# EAGLE design floppy IDC to SMT rev A (EAGLE 9.6.2)
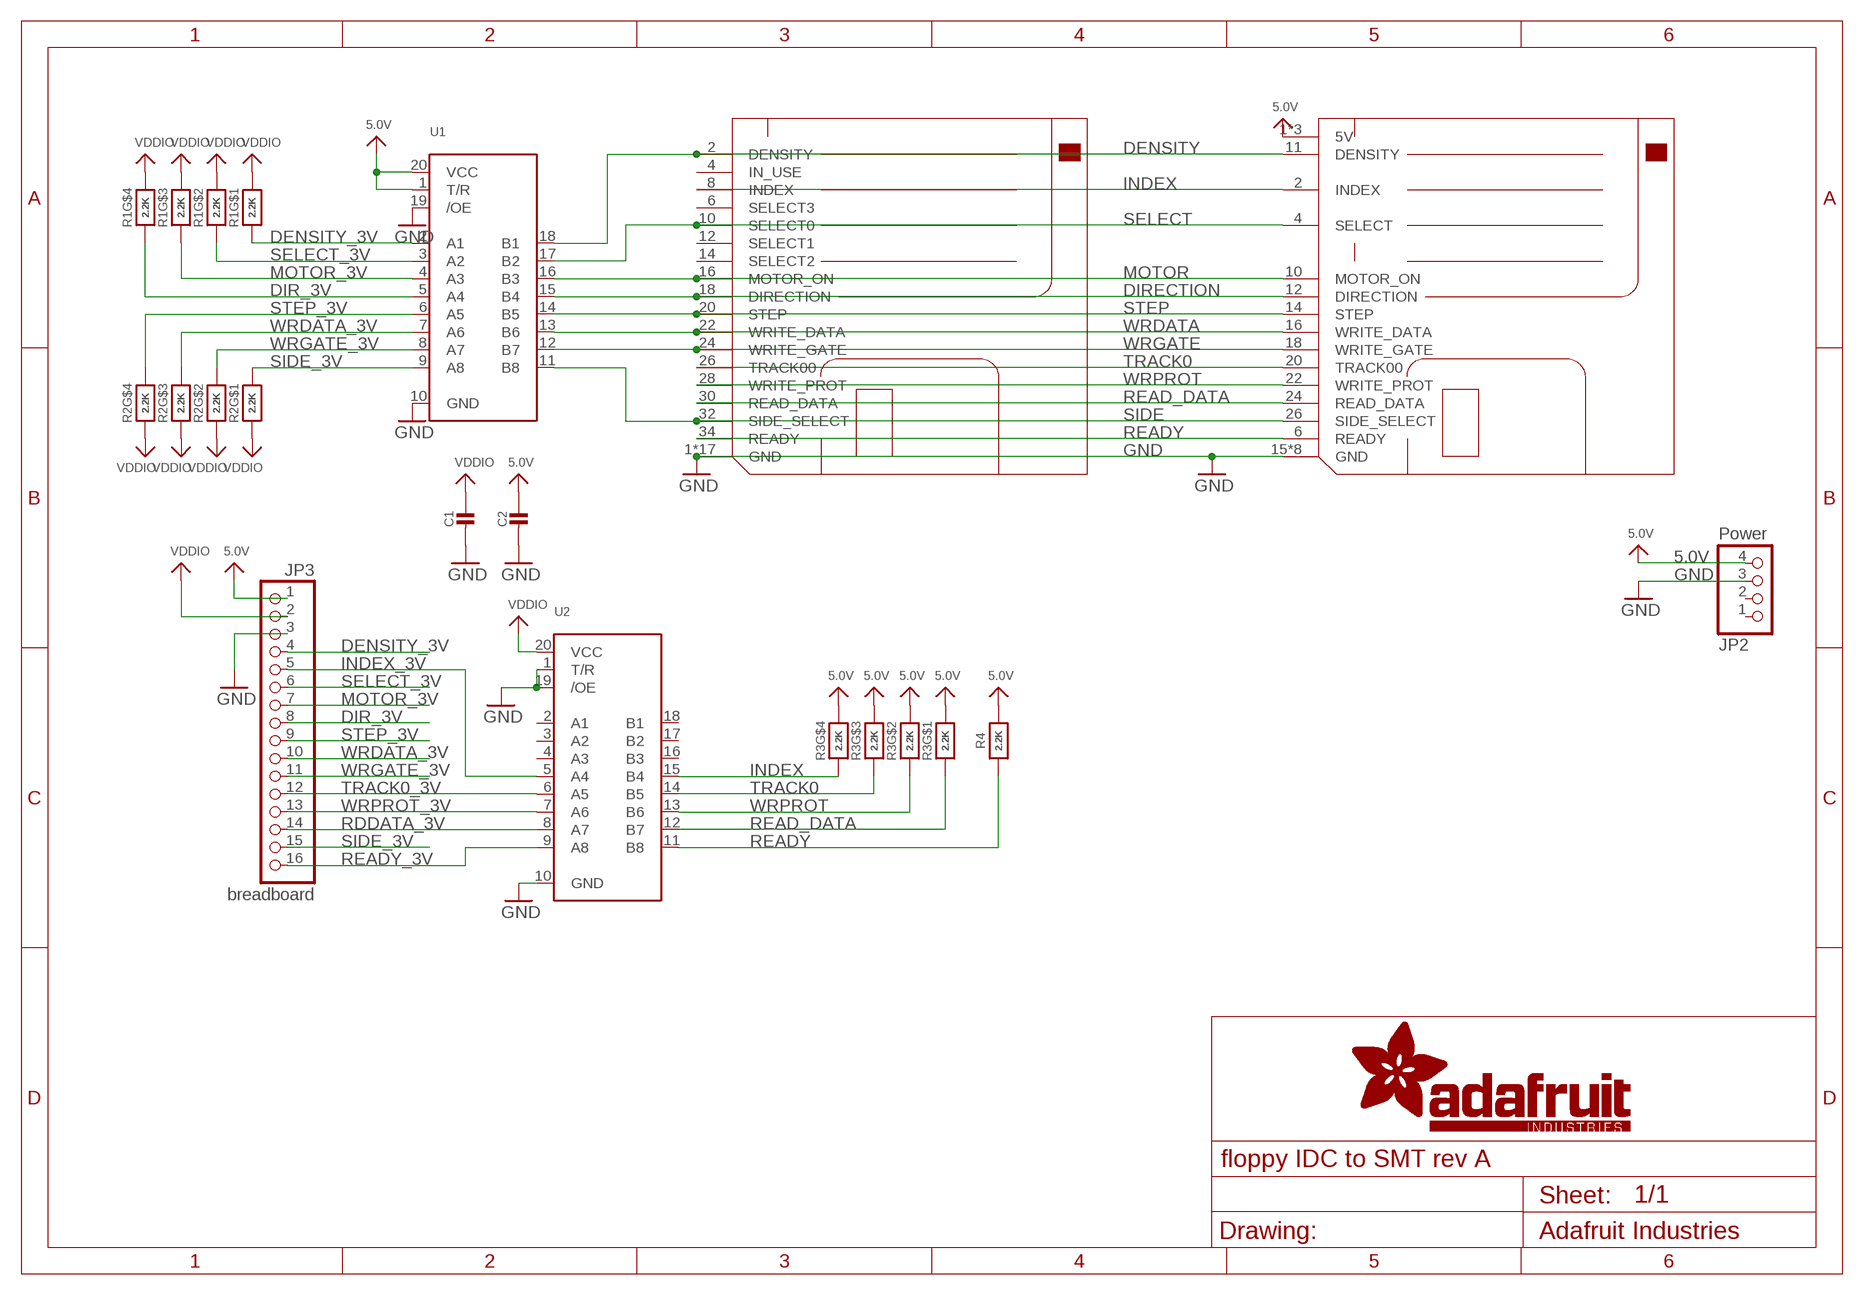
[diagram p0: schematic, sheet 1]

## Parts
C1  CAP_CERAMIC0805-NOOUTLINE  [0805-NO]
C2  CAP_CERAMIC0805-NOOUTLINE  [0805-NO]
FDD1  FLOPPY_IDC_SHROUDED  [2X17_FLOPPY_IDC]
FDD2  FLOPPY_FPC  [FPC_26P_1MM]
JP2  Power  PINHD-1X4/90  [1X04/90]
JP3  breadboard  PINHD-1X16  [1X16]
R1  2.2K  RESISTOR_4PACK  [RESPACK_4X0603]
R2  2.2K  RESISTOR_4PACK  [RESPACK_4X0603]
R3  2.2K  RESISTOR_4PACK  [RESPACK_4X0603]
R4  2.2K  RESISTOR_0603_NOOUT  [0603-NO]
U1  74LCX245  [TSSOP20]
U2  74LCX245  [TSSOP20]

## Nets
5.0V: C2.1 FDD2.1(5V) FDD2.3(5V) FDD2.5(5V) JP2.4 JP3.1 R3.5 R3.6 R3.7 R3.8 R4.2 U1.1(T/R) U1.20(VCC)
DENSITY: FDD1.2(DENSITY) FDD2.11(DENSITY) U1.18(B1)
DENSITY_3V: JP3.4 R1.1 U1.2(A1)
DIR_3V: JP3.8 R1.4 U1.5(A4)
DIRECTION: FDD1.18(DIRECTION) FDD2.12(DIRECTION) U1.15(B4)
GND: C1.2 C2.2 FDD1.1(GND) FDD1.3(GND) FDD1.5(GND) FDD1.7(GND) FDD1.9(GND) FDD1.11(GND) FDD1.13(GND) FDD1.15(GND) FDD1.17(GND) FDD1.19(GND) FDD1.21(GND) FDD1.23(GND) FDD1.25(GND) FDD1.27(GND) FDD1.29(GND) FDD1.31(GND) FDD1.33(GND) FDD2.15(GND) FDD2.17(GND) FDD2.19(GND) FDD2.21(GND) FDD2.23(GND) FDD2.25(GND) FDD2.M1(GND) FDD2.M2(GND) JP2.3 JP3.3 U1.10(GND) U1.19(/OE) U2.1(T/R) U2.10(GND) U2.19(/OE)
INDEX: FDD1.8(INDEX) FDD2.2(INDEX) R3.4 U2.15(B4)
INDEX_3V: JP3.5 U2.5(A4)
MOTOR: FDD1.16(MOTOR_ON) FDD2.10(MOTOR_ON) U1.16(B3)
MOTOR_3V: JP3.7 R1.3 U1.4(A3)
RDDATA_3V: JP3.14 U2.8(A7)
READ_DATA: FDD1.30(READ_DATA) FDD2.24(READ_DATA) R3.1 U2.12(B7)
READY: FDD1.34(READY) FDD2.6(READY) R4.1 U2.11(B8)
READY_3V: JP3.16 U2.9(A8)
SELECT: FDD1.10(SELECT0) FDD2.4(SELECT) U1.17(B2)
SELECT_3V: JP3.6 R1.2 U1.3(A2)
SIDE: FDD1.32(SIDE_SELECT) FDD2.26(SIDE_SELECT) U1.11(B8)
SIDE_3V: JP3.15 R2.8 U1.9(A8)
STEP: FDD1.20(STEP) FDD2.14(STEP) U1.14(B5)
STEP_3V: JP3.9 R2.5 U1.6(A5)
TRACK0: FDD1.26(TRACK00) FDD2.20(TRACK00) R3.3 U2.14(B5)
TRACK0_3V: JP3.12 U2.6(A5)
VDDIO: C1.1 JP3.2 R1.5 R1.6 R1.7 R1.8 R2.1 R2.2 R2.3 R2.4 U2.20(VCC)
WRDATA: FDD1.22(WRITE_DATA) FDD2.16(WRITE_DATA) U1.13(B6)
WRDATA_3V: JP3.10 R2.6 U1.7(A6)
WRGATE: FDD1.24(WRITE_GATE) FDD2.18(WRITE_GATE) U1.12(B7)
WRGATE_3V: JP3.11 R2.7 U1.8(A7)
WRPROT: FDD1.28(WRITE_PROT) FDD2.22(WRITE_PROT) R3.2 U2.13(B6)
WRPROT_3V: JP3.13 U2.7(A6)
Unconnected: FDD1.4(IN_USE) FDD1.6(SELECT3) FDD1.12(SELECT1) FDD1.14(SELECT2) JP2.1 JP2.2 U2.2(A1) U2.3(A2) U2.4(A3) U2.16(B3) U2.17(B2) U2.18(B1)

## Library data of the parts
C1 C2 = microbuilder:CAP_CERAMIC: Ceramic Capacitors For new designs, use the packages preceded by an '_' character since they are more reliable: The following footprints should be used on most boards: _0402 - Standard footprint for regular board layouts _0603 - Standard footprint for regular board layouts _0805 - Standard footprint for regular board layouts _1206 - Standard footprint for regular board layouts For extremely tight-pitch boards where space is at a premium, the following 'micro-pitch' footprints can be used (smaller pads, no silkscreen outline, etc.): _0402MP - Micro-pitch footprint for very dense/compact boards _0603MP - Micro-pitch footprint for very dense/compact boards _0805MP - Micro-pitch footprint for very dense/compact boards _1206MP - Micro-pitch footprint for very dense/compact boards
FDD1 = adafruit_electromech:FLOPPY_IDC
FDD2 = adafruit_electromech:FLOPPY_FPC
JP2 = pinhead:PINHD-1X4: PIN HEADER
JP3 = pinhead:PINHD-1X16: PIN HEADER
R1-R3 = microbuilder:RESISTOR_4PACK: Resistor Packs (4 resistors) 4 x 0603 10K 1/16W - Digikey: YC164J-10KCT-ND
R4 = microbuilder:RESISTOR: Resistors For new designs, use the packages preceded by an '_' character since they are more reliable: The following footprints should be used on most boards: _0402 - Standard footprint for regular board layouts _0603 - Standard footprint for regular board layouts _0805 - Standard footprint for regular board layouts _1206 - Standard footprint for regular board layouts For extremely tight-pitch boards where space is at a premium, the following 'micro-pitch' footprints can be used (smaller pads, no silkscreen outline, etc.): _0402MP - Micro-pitch footprint for very dense/compact boards _0603MP - Micro-pitch footprint for very dense/compact boards _0805MP - Micro-pitch footprint for very dense/compact boards _1206MP - Micro-pitch footprint for very dense/compact boards
U1 U2 = microbuilder:74LCX245: 74LCX245MTC - 5.0V Tolerant Bi-Directional Buffer Can be used to interface 5.0V logic to 2.5 or 3.3V devices Digikey: 74LCX245MTCXTR-ND Mouser: 512-74LCX245MTCX

## Board
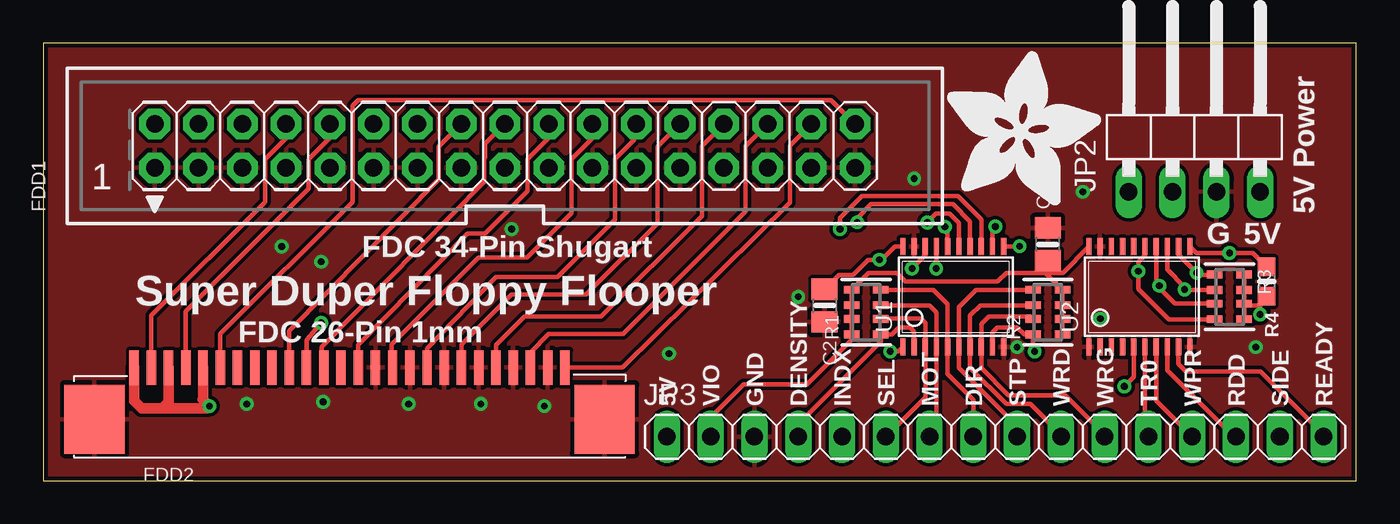
[diagram p1: board, top side]
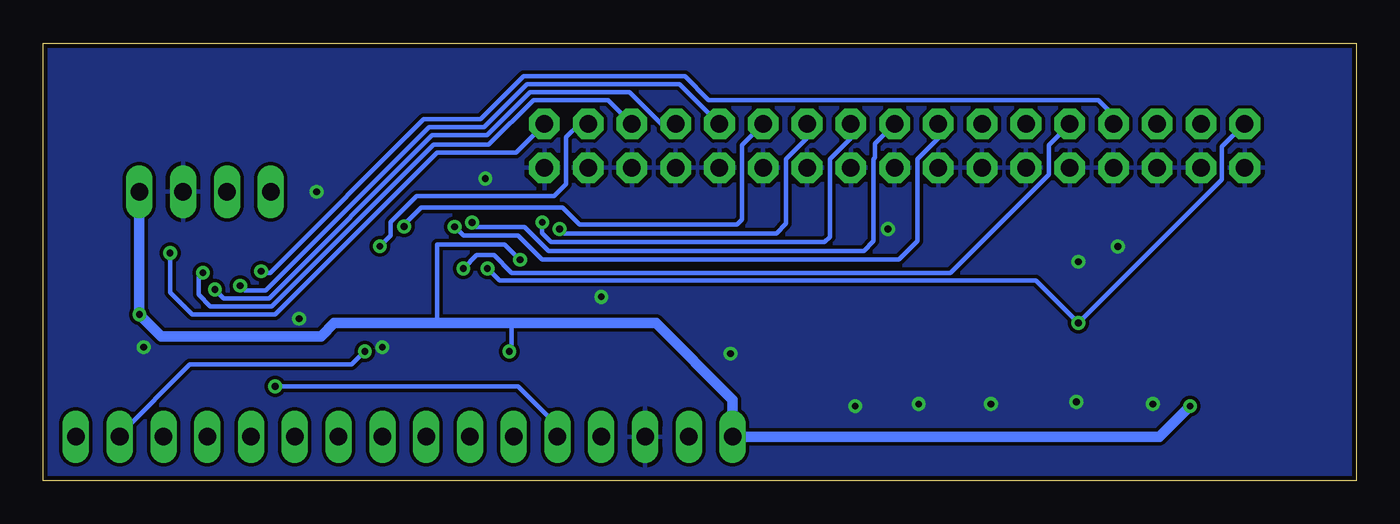
[diagram p2: board, bottom side, seen from below]

Size 76.2 x 25.4 mm. Coordinates in mm from the lower left corner, seen from the top.
Outline: 0,0 76.2,0 76.2,25.4 0,25.4 0,0
Copper layers (1*16): Top 0.035mm / dielectric 1.5mm / Bottom 0.035mm
Design rules "adafruit": minimum track width 8mil, minimum drill 15.5mil, track to track 8mil, track to pad 8mil, pad to pad 8mil, via to via 8mil, smd to smd 8mil, copper to edge 10mil, drill to drill 8mil, minimum pad ring 10mil, minimum via ring 8mil, stop-mask expansion 2mil, vias tented up to drill 20mil, thermal gap 10mil

### Footprints (pad centres in the part's own frame; a part is rotated, then mirrored left to right if it is on the bottom)
0805-NO = smd 1.24 x 1.5: 1 -0.95,0; 2 0.95,0
2X17_FLOPPY_IDC = drill 1.016 pad 1.778 octagon: 1 -1.27,20.32; 2 1.27,20.32; 3 -1.27,17.78; 4 1.27,17.78; 5 -1.27,15.24; 6 1.27,15.24; 7 -1.27,12.7; 8 1.27,12.7; 9 -1.27,10.16; 10 1.27,10.16; 11 -1.27,7.62; 12 1.27,7.62; 13 -1.27,5.08; 14 1.27,5.08; 15 -1.27,2.54; 16 1.27,2.54; 17 -1.27,0; 18 1.27,0; 19 -1.27,-2.54; 20 1.27,-2.54; 21 -1.27,-5.08; 22 1.27,-5.08; 23 -1.27,-7.62; 24 1.27,-7.62; 25 -1.27,-10.16; 26 1.27,-10.16; 27 -1.27,-12.7; 28 1.27,-12.7; 29 -1.27,-15.24; 30 1.27,-15.24; 31 -1.27,-17.78; 32 1.27,-17.78; 33 -1.27,-20.32; 34 1.27,-20.32
FPC_26P_1MM = smd 0.55 x 2: 1 -12.5,2.75; 2 -11.5,2.75; 3 -10.5,2.75; 4 -9.5,2.75; 5 -8.5,2.75; 6 -7.5,2.75; 7 -6.5,2.75; 8 -5.5,2.75; 9 -4.5,2.75; 10 -3.5,2.75; 11 -2.5,2.75; 12 -1.5,2.75; 13 -0.5,2.75; 14 0.5,2.75; 15 1.5,2.75; 16 2.5,2.75; 17 3.5,2.75; 18 4.5,2.75; 19 5.5,2.75; 20 6.5,2.75; 21 7.5,2.75; 22 8.5,2.75; 23 9.5,2.75; 24 10.5,2.75; 25 11.5,2.75; 26 12.5,2.75 | smd 3.5 x 4: M1 -14.8,-0.25; M2 14.8,-0.25
1X04/90 = drill 1.016 long: 1 -3.81,-3.81; 2 -1.27,-3.81; 3 1.27,-3.81; 4 3.81,-3.81
1X16 = drill 1.016 long: 1 -19.05,0; 2 -16.51,0; 3 -13.97,0; 4 -11.43,0; 5 -8.89,0; 6 -6.35,0; 7 -3.81,0; 8 -1.27,0; 9 1.27,0; 10 3.81,0; 11 6.35,0; 12 8.89,0; 13 11.43,0; 14 13.97,0; 15 16.51,0; 16 19.05,0
RESPACK_4X0603 = smd 0.45 x 0.9: 1 -1.3,-0.85; 2 -0.4,-0.85; 3 0.4,-0.85; 4 1.3,-0.85; 5 1.3,0.85; 6 0.4,0.85; 7 -0.4,0.85; 8 -1.3,0.85
0603-NO = smd 1.075 x 1: 1 -0.85,0; 2 0.85,0
TSSOP20 = smd 0.305 x 0.991: 1 -3.075,-2.918; 2 -2.425,-2.918; 3 -1.775,-2.918; 4 -1.125,-2.918; 5 -0.475,-2.918; 6 0.175,-2.918; 7 0.825,-2.918; 8 1.475,-2.918; 9 2.125,-2.918; 10 2.775,-2.918; 11 2.775,2.918; 12 2.125,2.918; 13 1.475,2.918; 14 0.825,2.918; 15 0.175,2.918; 16 -0.475,2.918; 17 -1.125,2.918; 18 -1.775,2.918; 19 -2.425,2.918; 20 -3.075,2.918

### Placement (x,y rotation side)
C1  58.29,13.72 90 top
C2  45.34,10.16 270 top
FDD1  26.8,19.43 90 top
FDD2  17.78,3.81 0 top
JP2  66.8,20.57 0 top
JP3  55.24,2.54 0 top
R1  47.75,9.78 90 top
R2  58.29,9.78 90 top
R3  68.83,10.67 270 top
R4  70.99,11.56 270 top
U1  52.96,10.67 0 top
U2  63.75,10.67 0 top
U$23  [ADAFRUIT_9MM]  52.45,16 0 top

### Tracks (layer width: path | path; a pad name or v marks a point on that pad's centre or on a via)
5.0V  (via drill 0.39)
  Top 0.254: U1.20 49.42,13.59 48.65,12.82 v48.52,12.82 47.87,12.82 46.99,11.94 46.17,11.94 C2.1 | R3.5 69.68,10.16 | 69.68,10.16 R3.6 R3.7 R3.8 | 70.61,10.29 70.61,10.33 R4.2 | 70.61,10.29 70.48,10.16 69.68,10.16 | 70.61,10.29 v70.61,9.65 | U1.1 49.63,7.49 v49.15,7.49
  Top 0.61: FDD2.1 5.28,4.63 5.71,4.19 6.9,4.19 | FDD2.5 9.28,4.82 9.26,4.71 v9.65,4.32 9.53,4.19 6.9,4.19 | FDD2.3 7.28,4.57 6.9,4.19
  Bottom 0.254: v48.52,12.82 49.41,13.71 53.34,13.71 53.34,9.14 | v49.15,7.49 49.02,7.62 49.02,9.14
  Bottom 0.61: v9.65,4.32 11.43,2.54 JP3.1 36.2,4.7 40.64,9.14 49.02,9.14 53.34,9.14 59.31,9.14 60.07,8.38 69.34,8.38 v70.61,9.65 JP2.4
DENSITY  (via drill 0.39)
  Top 0.254: FDD2.11 15.28,8.17 v16.13,9.14 | U1.18 51.18,13.08 v50.42,12.32
  Bottom 0.254: FDD1.2 7.8,19.38 7.8,17.48 v16.13,9.14 18.59,11.61 49.71,11.61 v50.42,12.32
DENSITY_3V
  Top 0.254: U1.2 50.53,8.65 50.29,8.89 49.66,8.89 49.25,8.48 R1.1 48.6,8.09 43.81,3.3 JP3.4
DIR_3V
  Top 0.254: R1.4 51.66,11.08 52.48,10.25 U1.5 52.48,6.19 53.98,4.7 JP3.8
DIRECTION  (via drill 0.39)
  Top 0.254: FDD2.12 16.15,6.69 16.15,7.77 25.58,17.32 25.58,18.67 25.65,18.74 25.65,19.56 FDD1.18 | U1.15 53.13,14.96 52.59,15.49 51.82,15.49 v51.31,14.99
  Bottom 0.254: v51.31,14.99 51.31,14.73 48.26,14.73 46.86,13.34 28.57,13.34 28.02,13.89 28.02,18.67 27.94,18.74 27.94,19.56 FDD1.18
GND  (via drill 0.39)
  other vias: 16.13,12.7 13.84,13.59 21.21,4.45 16.26,4.57 11.81,4.45 25.4,4.45 29.08,4.32 50.55,17.53 56.52,7.75 61.34,9.4 70.36,7.75 60.33,16.76 43.81,10.67 36.32,7.37 27.18,14.61
  pour Top: 0,25.4 76.2,25.4 76.2,0 0,0
  pour Bottom: 0,25.4 76.2,25.4 76.2,0 0,0
INDEX  (via drill 0.39)
  Top 0.254: FDD2.2 6.28,9.58 12.88,16.18 12.88,18.67 14.1,19.89 FDD1.8 | U2.15 63.93,13.08 63.55,12.7 v63.55,12.15 63.55,11.13 65.31,9.37 R3.4
  Bottom 0.254: v63.55,12.15 63.46,12.06 63.04,12.06 54.12,20.98 50.81,20.98 48.32,23.47 38.96,23.47 37.59,22.1 14.99,22.1 14.1,21.21 FDD1.8 | v63.55,12.15 | v63.55,12.15
INDEX_3V  (via drill 0.39)
  Top 0.254: U2.5 63.28,6.02 v62.73,5.47
  Bottom 0.254: v62.73,5.47 48.65,5.47 46.35,3.17 JP3.5
MOTOR  (via drill 0.39)
  Top 0.254: FDD2.10 14.28,8.69 22.94,17.48 22.94,19.38 FDD1.16 | v52.32,14.73 52.32,14.61 52.48,14.45 U1.16
  Bottom 0.254: FDD1.16 24.26,19.89 25.48,18.67 25.48,13.89 26.54,12.83 47.24,12.83 48.64,14.22 51.82,14.22 v52.32,14.73
MOTOR_3V
  Top 0.254: R1.3 48.77,10.18 51.42,10.18 51.83,9.76 U1.4 51.83,2.94 JP3.7 | R1.3
RDDATA_3V
  Top 0.254: U2.8 65.23,6.4 69.09,2.54 JP3.14
READ_DATA  (via drill 0.39)
  Top 0.254: FDD2.24 28.28,7.45 29.34,8.51 33.66,8.51 40.77,15.62 40.77,19.43 FDD1.30 | U2.12 65.88,13.12 v66.93,12.06 67.06,11.94 67.95,11.94 R3.1
  Bottom 0.254: FDD1.30 43.43,22.1 47.75,22.1 50.34,19.51 53.53,19.51 62.93,10.11 66.5,10.11 67.18,10.79 67.18,11.81 v66.93,12.06
READY  (via drill 0.39)
  Top 0.254: U2.11 66.91,13.21 v68.83,13.21 70.19,13.21 R4.1 | FDD1.34 45.72,22.1 18.29,22.1 17.96,21.77 17.96,16.18 10.28,8.5 FDD2.6
  Bottom 0.254: FDD1.34 48.77,19.05 53.34,19.05 62.74,9.65 67.56,9.65 68.83,10.92 v68.83,13.21
READY_3V
  Top 0.254: U2.9 65.88,6.76 66.29,6.35 70.61,6.35 74.3,2.67 JP3.16
SELECT  (via drill 0.39)
  Top 0.254: FDD2.4 8.28,9.8 15.42,16.94 15.42,18.67 16.64,19.89 FDD1.10 | U1.17 51.83,12.46 51.83,12.32 v51.82,12.32
  Bottom 0.254: FDD1.10 17.86,19.48 17.86,17.76 23.55,12.06 49.02,12.06 50.04,13.08 51.05,13.08 v51.82,12.32
SELECT_3V
  Top 0.254: R1.2 48.62,9.4 50.93,9.4 51.18,9.14 U1.3 51.18,4.83 JP3.6
SIDE  (via drill 0.39)
  Top 0.254: FDD2.26 33.62,6.56 43.34,16.15 43.34,19.46 FDD1.32 | U1.11 56.66,13.59 v56.66,13.61
  Bottom 0.254: v56.66,13.61 56.02,14.24 56.02,15 54.52,16.51 46.55,16.51 45.85,17.22 45.85,19.94 45.09,20.7 FDD1.32
SIDE_3V  (via drill 0.39)
  Top 0.254: U1.9 55.08,8.6 55.37,8.89 56.52,8.89 56.93,8.48 R2.8 57.44,7.58 v57.53,7.49
  Bottom 0.254: v57.53,7.49 58.29,6.73 67.69,6.73 71.75,2.67 JP3.15
STEP  (via drill 0.39)
  Top 0.254: FDD2.14 18.28,7.87 24.62,14.35 25.65,14.35 28.12,16.82 28.12,18.67 29.34,19.89 FDD1.20 | U1.14 53.78,15.05 52.79,16.05 48.03,16.05 47.24,15.25 v47.24,14.99
  Bottom 0.254: v47.24,14.99 47.24,14.36 46.73,13.85 30.85,13.85 30.56,14.15 30.56,18.67 29.34,19.89 FDD1.20
STEP_3V
  Top 0.254: R2.5 54.13,11.08 53.13,10.08 U1.6 53.13,6.54 56.52,3.16 JP3.9
TRACK0  (via drill 0.39)
  Top 0.254: FDD2.20 24.28,7.9 27.18,10.79 31.5,10.79 35.64,14.94 35.64,19.38 FDD1.26 | U2.14 64.58,11.68 | 64.58,11.68 64.58,11.37 65.68,10.27 R3.3 | 64.58,11.68 64.77,11.49 v64.77,11.32
  Bottom 0.254: FDD1.26 39.27,23.01 48.13,23.01 50.62,20.52 53.81,20.52 63.29,11.04 64.5,11.04 v64.77,11.32
TRACK0_3V
  Top 0.254: U2.6 63.93,2.75 JP3.12
VDDIO
  Top 0.254: R2.1 R2.2 R2.3 R2.4 58.17,12.06 | 58.17,12.06 55.88,12.06 55.37,11.56 50.04,11.56 49.53,12.06 47.89,12.06 R1.5 R1.6 R1.7 R1.8 46.9,8.17 44.32,5.59 40.64,5.59 38.73,3.68 JP3.2 | 58.17,12.06 59.16,12.06 U2.20 | C1.1 58.29,12.19 58.17,12.06
WRDATA  (via drill 0.39)
  Top 0.254: FDD2.16 20.22,6.62 20.22,7.9 25.27,12.95 28.07,12.95 30.66,15.54 30.66,18.67 31.88,19.89 FDD1.22 | U1.13 54.43,15.16 53.09,16.51 47.5,16.51 46.23,15.24 v46.23,14.61
  Bottom 0.254: v46.23,14.61 45.98,14.35 33.66,14.35 33.1,14.91 33.1,18.67 31.88,19.89 FDD1.22
WRDATA_3V
  Top 0.254: R2.6 54.38,10.18 53.78,9.59 U1.7 53.78,6.54 55.88,4.45 57.28,4.45 59.05,2.67 JP3.10
WRGATE  (via drill 0.39)
  Top 0.254: FDD2.18 22.28,7.67 26.28,11.81 29.84,11.81 33.2,15.16 33.2,18.67 34.29,19.76 34.29,20.57 FDD1.24 | v55.25,14.74 55.08,14.57 U1.12
  Bottom 0.254: v55.25,14.74 55.32,14.8 54.28,15.84 46.06,15.84 45.07,14.86 35.94,14.86 35.64,15.16 35.64,19.48 FDD1.24
WRGATE_3V
  Top 0.254: R2.7 57.3,9.53 54.86,9.53 54.43,9.1 U1.8 54.43,6.54 56.02,4.95 59.31,4.95 61.59,2.67 JP3.11
WRPROT  (via drill 0.39)
  Top 0.254: FDD2.22 26.28,7.87 27.94,9.53 32.38,9.53 38.23,15.37 38.23,19.43 FDD1.28 | U2.13 65.23,12.24 66.23,11.24 | R3.2 67.56,11.07 66.4,11.07 66.23,11.24 | v66.23,11.09 66.23,11.24 | R3.2
  Bottom 0.254: FDD1.28 40.31,20.7 42.17,22.55 47.94,22.55 50.43,20.07 53.62,20.07 63.1,10.59 65.72,10.59 v66.23,11.09
WRPROT_3V
  Top 0.254: U2.7 64.58,4.64 JP3.13

### Text on the board
tPlace: 5V Power | FDC 34-Pin Shugart | G | 5V | Super Duper Floppy Flooper | FDC 26-Pin 1mm | 5V | VIO | GND | DENSITY | INDX | SEL | MOT | DIR | STP | WRD | WRG | TR0 | WPR | RDD | SIDE | READY